# Altium schematic sheet MainSch.SchDoc
size 420 x 297 mm; Author: Ronald Tun; DrawnBy: Ronald Tun; Revision: 1; SheetNumber: 1; SheetTotal: 2
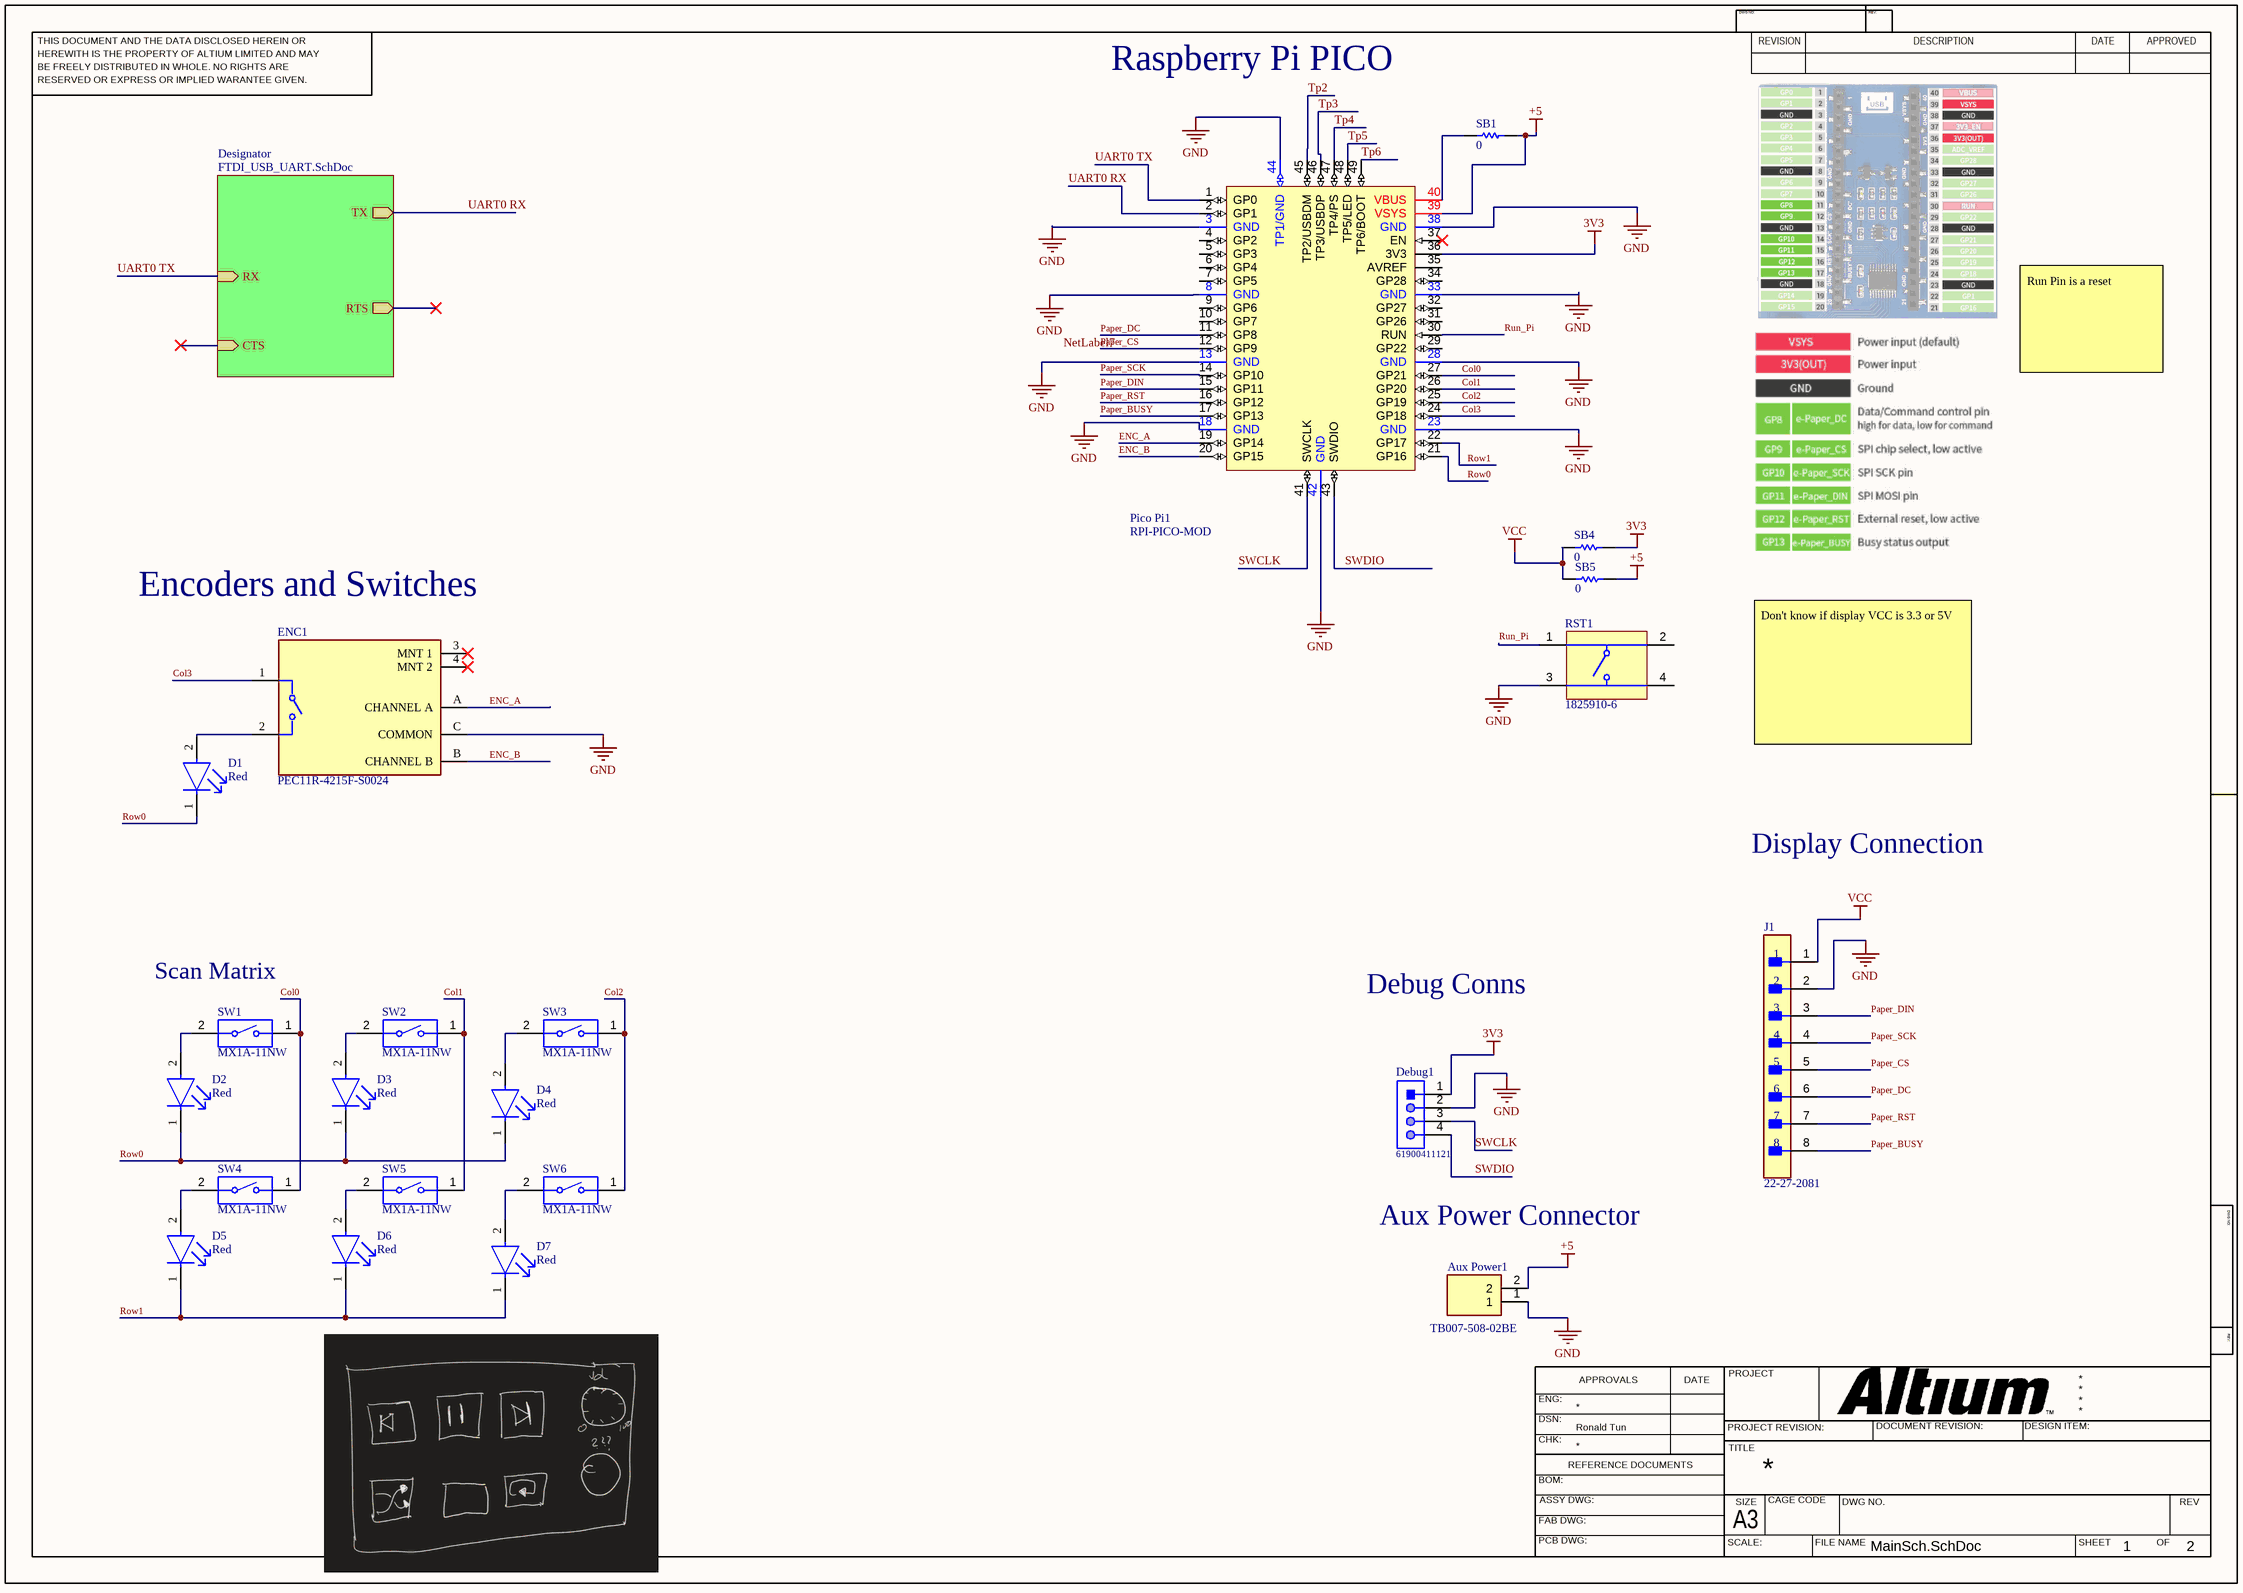
[diagram p0: MainSch.SchDoc]

## Parts
Aux_Power1  TB007-508-02BE  [TB00750802BE]
D1  Red  [FP-150080SS75000-MFG]
D2  Red  [FP-150080SS75000-MFG]
D3  Red  [FP-150080SS75000-MFG]
D4  Red  [FP-150080SS75000-MFG]
D5  Red  [FP-150080SS75000-MFG]
D6  Red  [FP-150080SS75000-MFG]
D7  Red  [FP-150080SS75000-MFG]
Debug1  61900411121  [61900411121]
ENC1  PEC11R-4215F-S0024  [FP-PEC11R-4215F-S0024-MFG]
J1  22-27-2081  [FP-22-27-2081-MFG]
Pico_Pi1  RPI-PICO-MOD  [RPI-PICO-MOD]
RST1  1825910-6  [TECO-1825910-6_V]
SB1  0  [RESC1608X55X25ML10T15]
SB4  0  [RESC1608X55X25ML10T15]
SB5  0  [RESC1608X55X25ML10T15]
SW1  MX1A-11NW  [CHRY-MX1A-11NW_V]
SW2  MX1A-11NW  [CHRY-MX1A-11NW_V]
SW3  MX1A-11NW  [CHRY-MX1A-11NW_V]
SW4  MX1A-11NW  [CHRY-MX1A-11NW_V]
SW5  MX1A-11NW  [CHRY-MX1A-11NW_V]
SW6  MX1A-11NW  [CHRY-MX1A-11NW_V]

## Sub-sheets
Designator = FTDI_USB_UART.SchDoc: TX (out), RX (in), CTS (in), RTS (out)

## Nets
3V3: Debug1.1 Pico_Pi1.36(3V3) SB4.1
+5: Aux_Power1.2 Pico_Pi1.39(VSYS) SB1.1 SB5.1
GND: Aux_Power1.1 Debug1.2 ENC1.C(COMMON) J1.2 Pico_Pi1.3(GND) Pico_Pi1.8(GND) Pico_Pi1.13(GND) Pico_Pi1.18(GND) Pico_Pi1.23(GND) Pico_Pi1.28(GND) Pico_Pi1.33(GND) Pico_Pi1.38(GND) Pico_Pi1.42(GND) Pico_Pi1.44(TP1/GND) RST1.3
VCC: J1.1 SB4.2 SB5.2
Col0: Pico_Pi1.27(GP21) SW1.1 SW4.1
Col1: Pico_Pi1.26(GP20) SW2.1 SW5.1
Col2: Pico_Pi1.25(GP19) SW3.1 SW6.1
Col3: ENC1.1 Pico_Pi1.24(GP18)
ENC_A: ENC1.A(CHANNEL_A) Pico_Pi1.19(GP14)
ENC_B: ENC1.B(CHANNEL_B) Pico_Pi1.20(GP15)
Paper_BUSY: J1.8 Pico_Pi1.17(GP13)
Paper_CS: J1.5 Pico_Pi1.12(GP9)
Paper_DC: J1.6 Pico_Pi1.11(GP8)
Paper_DIN: J1.3 Pico_Pi1.15(GP11)
Paper_RST: J1.7 Pico_Pi1.16(GP12)
Paper_SCK: J1.4 Pico_Pi1.14(GP10)
Row0: D1.1(C) D2.1(C) D3.1(C) D4.1(C) Pico_Pi1.21(GP16)
Row1: D5.1(C) D6.1(C) D7.1(C) Pico_Pi1.22(GP17)
Run_Pi: Pico_Pi1.30(RUN) RST1.1
SWCLK: Debug1.3 Pico_Pi1.41(SWCLK)
SWDIO: Debug1.4 Pico_Pi1.43(SWDIO)
Tp2: Pico_Pi1.45(TP2/USBDM)
Tp3: Pico_Pi1.46(TP3/USBDP)
Tp4: Pico_Pi1.47(TP4/PS)
Tp5: Pico_Pi1.48(TP5/LED)
Tp6: Pico_Pi1.49(TP6/BOOT)
UART0 RX: Pico_Pi1.2(GP1) ; sheet Designator/TX
UART0 TX: Pico_Pi1.1(GP0) ; sheet Designator/RX
NetD1_2: D1.2(A) ENC1.2
NetD2_2: D2.2(A) SW1.2
NetD3_2: D3.2(A) SW2.2
NetD4_2: D4.2(A) SW3.2
NetD5_2: D5.2(A) SW4.2
NetD6_2: D6.2(A) SW5.2
NetD7_2: D7.2(A) SW6.2
NetPico_Pi1_40: Pico_Pi1.40(VBUS) SB1.2

Not connected (* = marked no-connect by the designer): ENC1 3(MNT_1)* 4(MNT_2)*; Pico_Pi1 4(GP2) 5(GP3) 6(GP4) 7(GP5) 9(GP6) 10(GP7) 29(GP22) 31(GP26) 32(GP27) 34(GP28) 35(AVREF) 37(EN)*; RST1 2 4

## Notes on the sheet
- Raspberry Pi PICO
- Run Pin is a reset
- (near ENC1) Encoders and Switches
- Don't know if display VCC is 3.3 or 5V
- Display Connection
- (near SW1) Scan Matrix
- Debug Conns
- Aux Power Connector
- Labels drawn without touching a wire or pin: NetLabel7
- THIS DOCUMENT AND THE DATA DISCLOSED HEREIN OR
- HEREWITH IS THE PROPERTY OF ALTIUM LIMITED AND MAY
- DWG NO:
- REVISION
- REV:
- DESCRIPTION
- DATE
- APPROVED
- BE FREELY DISTRIBUTED IN WHOLE. NO RIGHTS ARE
- RESERVED OR EXPRESS OR IMPLIED WARANTEE GIVEN.
- ENG:
- APPROVALS
- PROJECT
- DSN:
- CHK:
- REFERENCE DOCUMENTS
- PROJECT REVISION:
- TITLE
- DOCUMENT REVISION:
- DESIGN ITEM:
- BOM:
- FAB DWG:
- PCB DWG:
- ASSY DWG:
- SCALE:
- A3
- SIZE
- CAGE CODE
- FILE NAME
- DWG NO.
- SHEET
- OF
- REV

## Library data of the parts
Aux_Power1 = TB007-508-02BE: Connector; Manufacturer_Name: CUI Inc.; Datasheet Link: https://datasheet.datasheetarchive.com/originals/distributors/Datasheets_SAMA/67395fd1cd6fc86e483d0d8269f76301.pdf; Height: 14mm; Manufacturer_Part_Number: TB007-508-02BE; Mouser Part Number: 490-TB007-508-02BE; Mouser Price/Stock: https://www.mouser.co.uk/ProductDetail/CUI-Devices/TB007-508-02BE?qs=vLWxofP3U2y6PFKAfCqKUQ%3D%3D; Arrow Part Number: TB007-508-02BE; Arrow Price/Stock: https://www.arrow.com/en/products/tb007-508-02be/cui-devices?region=nac
D1-D7 = CMP-1426-00010-2: LED RED CLEAR 0805 SMD; Forward Voltage: 1.9V; Luminous Intensity: 60mcd; Dominant Wavelength: 630nm; Forward Current: 30mA; Viewing Angle: 140°; Lens Color: Colorless; Test Current: 20mA; Lens Size: 1.25mm; Packaging: Cut Tape; Width: 1.25mm; Case Code (Metric): 2012; Max Operating Temperature: 85°C; RoHS Compliant: Yes; Mount: Surface Mount; Case/Package: 0805; Series: WL-SMCW; Length: 2mm; Case Code (Imperial): 0805; Wavelength: 630nm; Lens Style: Clear; Min Operating Temperature: -40°C; Color: Red; Lens Transparency: Clear; Package Quantity: 1; Height: 0.8mm
Debug1 = CMP-1502-00586-1: Male Locking Header WR-WTB, THT, Vertical, pitch 2.54 mm, 1 x 4 position; Manufacturer: Wurth Elektronik; Working Voltage: 250VAC; Pitch: 2.54mm; Contact Resistance: 20mOhm; Position: 1x4; Publisher: WurthElektronik; Manufacturer URL: http://www.we-online.de; Datasheet URL: https://katalog.we-online.de/em/datasheet/6190xx11121.pdf; Operating Temperature: -40to105degC; Packaging: Bag; Gender: Male; Package Reference: 61900411121; Orientation: Vertical; Mounting Technology: THT; Part Number: 61900411121
ENC1 = CMP-1747-00012-2: ROTARY ENCODER MECHANICAL 24PPR; Hole Diameter: 1.8mm; Output Type: Quadrature; Pulses per Revolution: 24; Number of Channels: 2; Built in Switch: Yes; Min Operating Temperature: -30°C; Series: PEC11R; Type: Mechanical; Package Quantity: 150; Length: 21.5mm; Max Operating Temperature: 70°C; Encoder Type: Mechanical; Height: 13.4mm; Detent: Yes; Packaging: Bulk; Orientation: Vertical; Width: 12.5mm; Termination: PC Pins; Mount: Through Hole; REACH SVHC: No SVHC; Radiation Hardening: No; RoHS Compliant: Yes
J1 = CMP-04776-000265-1: CONN HEADER VERT 8POS 2.54MM; Voltage Rating (AC): 250V; Contact Resistance: 10mR; Number of Circuits: 8; Gender: Male; Current Rating: 4A; Insulation Resistance: 50GR; Hole Diameter: 1.02mm; Glow Wire Compliant: Non-compliant; Series: KK® 6410; Color: Natural; Material: Nylon; Lead Pitch: 2.54mm; Fastening Type: Friction; Voltage Rating: 250V; Pitch: 2.54mm; Max Operating Temperature: 75°C; Number of Poles: 8; Packaging: Bulk; Housing Color: White; RoHS Compliant: Yes; Halogen Free: Low Halogen; Number of Positions: 8; Package Quantity: 8000; Termination: Solder; Number of Contacts: 8; Number of Rows: 1; Housing Material: Nylon; Depth: 5.8mm; Contact Mating Length: 0.295inch; Orientation: Straight; Working Voltage: 250V; Contact Material: Brass; Contact Type: Male Pin; Voltage Rating (DC): 250V; Lead Free: Lead Free; Radiation Hardening: No; Mount: Through Hole; Min Operating Temperature: 0°C; Contact Plating: Tin; Flammability Rating: UL94 V-0
Pico_Pi1 = RPI-PICO-MOD: RASPBERRY PI PICO RP2040 BOARD; Manufacturer: Raspberry Pi Foundation; Manufacturer Part No: SC0915; Mounting Technology: SMT; Supplier: DigiKey; Supplier Part No: 2648-SC0915CT-ND; Supplier Link: https://www.digikey.com/en/products/detail/raspberry-pi/SC0915/13684020
RST1 = CMP-1684-00021-1: Tact Switch, SPST-NO, 0.05 A, -35 to 85 degC, 4-Pin THD, RoHS, Bulk; Manufacturer: TE Connectivity; Maximum Contact Resistance: 100mOhm; Mechanical Life: 100000Cycles; Bushing Type: Unthreaded; Switch Configuration: OFF(ON); Maximum DC Voltage Rating: 24V; Contact Rating @ Voltage: 0.05A@24VDC; Actuator Color: Black; Body Orientation: Straight; Function: MomentaryContact; Illumination: N/R; Actuator Style: RoundButton; Actuator Material: PolybutyleneTerephthalate; Dielectric Strength: 500VAC; Pole Throw Configuration: SPST; Actuator Length: 1.4mm; Product Weight: N/A; Contact Material: CopperAlloy; Housing Material: N/A; Terminal Type: PCPins; Minimum Insulation Resistance: 100MOhm; Package Description: 4-Pin Through Hole Device, Body 5.99 x 5.99 mm, Pitch 6.5 mm; Part No: 1825910-6; Package Reference: THD; Base Material: N/A; Manufacturer URL: http://www.te.com; Contact Plating: Silver; RoHS: Yes; Datasheet Version: Rev. C9; Electrical Life: 100000Cycles; Maximum AC Voltage Rating: N/A; Thread Size: N/R; Operating Temperature: -35to85C; Mounting: ThroughHole; Dimension: 5.99x5mm; Datasheet URL: http://www.te.com/commerce/DocumentDelivery/DDEController?Action=showdoc&DocId=Customer+Drawing%7F1825910%7FC9%7Fpdf%7FEnglish%7FENG_CD_1825910_C9.pdf%7F1825910-6; Family: 1825910; Seal Location: N/A; Seal Description: N/A; Packaging: N/A
SB1 SB4 SB5 = CMP-2100-03667-1: Chip Resistor, 0 Ohm, +/- 5%, 0.1 W, -55 to 155 degC, 0603 (1608 Metric), RoHS, Tape and Reel; Manufacturer: Yageo; Temperature Coefficient: 200ppm/degreesC; Voltage Rating: 50V; Power Rating: 100mW; Resistance: 0mOhm; Width: 0.8mm; Max Operating Temperature: 155degC; Tolerance: 5%; Package Reference: 0603; Height: 0.45mm; Depth: 0.8mm; Package Description: 2-Pin Surface Mount Device, Body 1.6 x 0.8 mm; Termination: SMD/SMT; Package Quantity: 5000; Case/Package: 0603; Case Code (Imperial): 0603; Radiation Hardening: No; Number of Pins: 2; Length: 1.6mm; Lead Free: LeadFree; Voltage Rating (DC): 50V; Military Standard: Not; Datasheet URL: http://www.yageo.com/NewPortal/yageodocoutput?fileName=/pdf/R-Chip/PYu-RC_Group_51_RoHS_L_5.pdf; Manufacturer URL: http://www.yageo.com/; Packaging: TapeandReel; Case Code (Metric): 1608; Min Operating Temperature: -55degC; Composition: ThickFilm; RoHSCompliant: true; Contact Plating: Tin; Datasheet Version: Rev. 5, 10/2016; REACH SVHC: NoSVHC
SW1-SW6 = CMP-2000-06786-1: Keylock Switch, 12 V, -10 to 70 degC, 2-Pin THD, RoHS, Bulk; Manufacturer: Cherry; Part No: MX1A11NW; Maximum DC Voltage Rating: 12V; COO: UK; Row Spacing: 6.35mm; Pole Throw Configuration: SPST; Total Travel: 4.06mm; Illumination Type: N/R; Actuator Style: Button; Operating Force: 0.58N; Electrical Life: 50000000Cycle; Minimum Insulation Resistance: 100MOhm; Body Orientation: Straight; Actuator Length: 3.6mm; Switch Configuration: N.O.; Maximum Current Rating: 0.01A; Maximum Contact Resistance: 200mOhm; Actuator Color: N/A; Terminal Type: PCPins; Operating Temperature: -10to70C; Number of Terminals: 2; Operating Speed: N/A; Maximum AC Voltage Rating: 12V; Housing Material: N/A; Datasheet URL: https://cdn.sparkfun.com/datasheets/Components/Switches/MX%20Series.pdf; Type: DesktopProfile; Terminal Pitch: 2.54mm; Package Reference: MX1A-11NW; ECCN: EAR99; Family: MX; Packaging: N/A; HTS: 8536509065; Actuator Material: N/A; Package Description: 2-Pin Through Hole Device, Body 15.6 x 15.6 mm; Dielectric Strength: N/A; Illumination Color: N/R; Manufacturer URL: http://cherryswitches.com/cn/; Dimension: 15.6x15.6x15.2mm; Mechanical Life: N/A; RoHS: Unknown; Contact Plating: N/A; Supplier: CherryElectrical; Contact Material: Silver/Gold; IP Rating: N/A; Mounting: ThroughHole; Datasheet Version: 09/2000; Maximum Power Rating: N/A; Mounting Technology: ThroughHole